# Altium schematic sheet PP_2_0.SchDoc: Плата управления
size 594 x 420 mm; ApprovedBy: Ярмолинская; CheckedBy: Ярмолинская; DrawnBy: Ярмолинский; Organization: Школа №255; DocumentNumber: 53251498.468331.01.04.00 Э3; SheetNumber: 1; SheetTotal: 5; Title1str: электродвигателями; DocumentType: Схема электрическая принципиальная; Format: A2; ImagePath: 53251498.468331.01.02.00
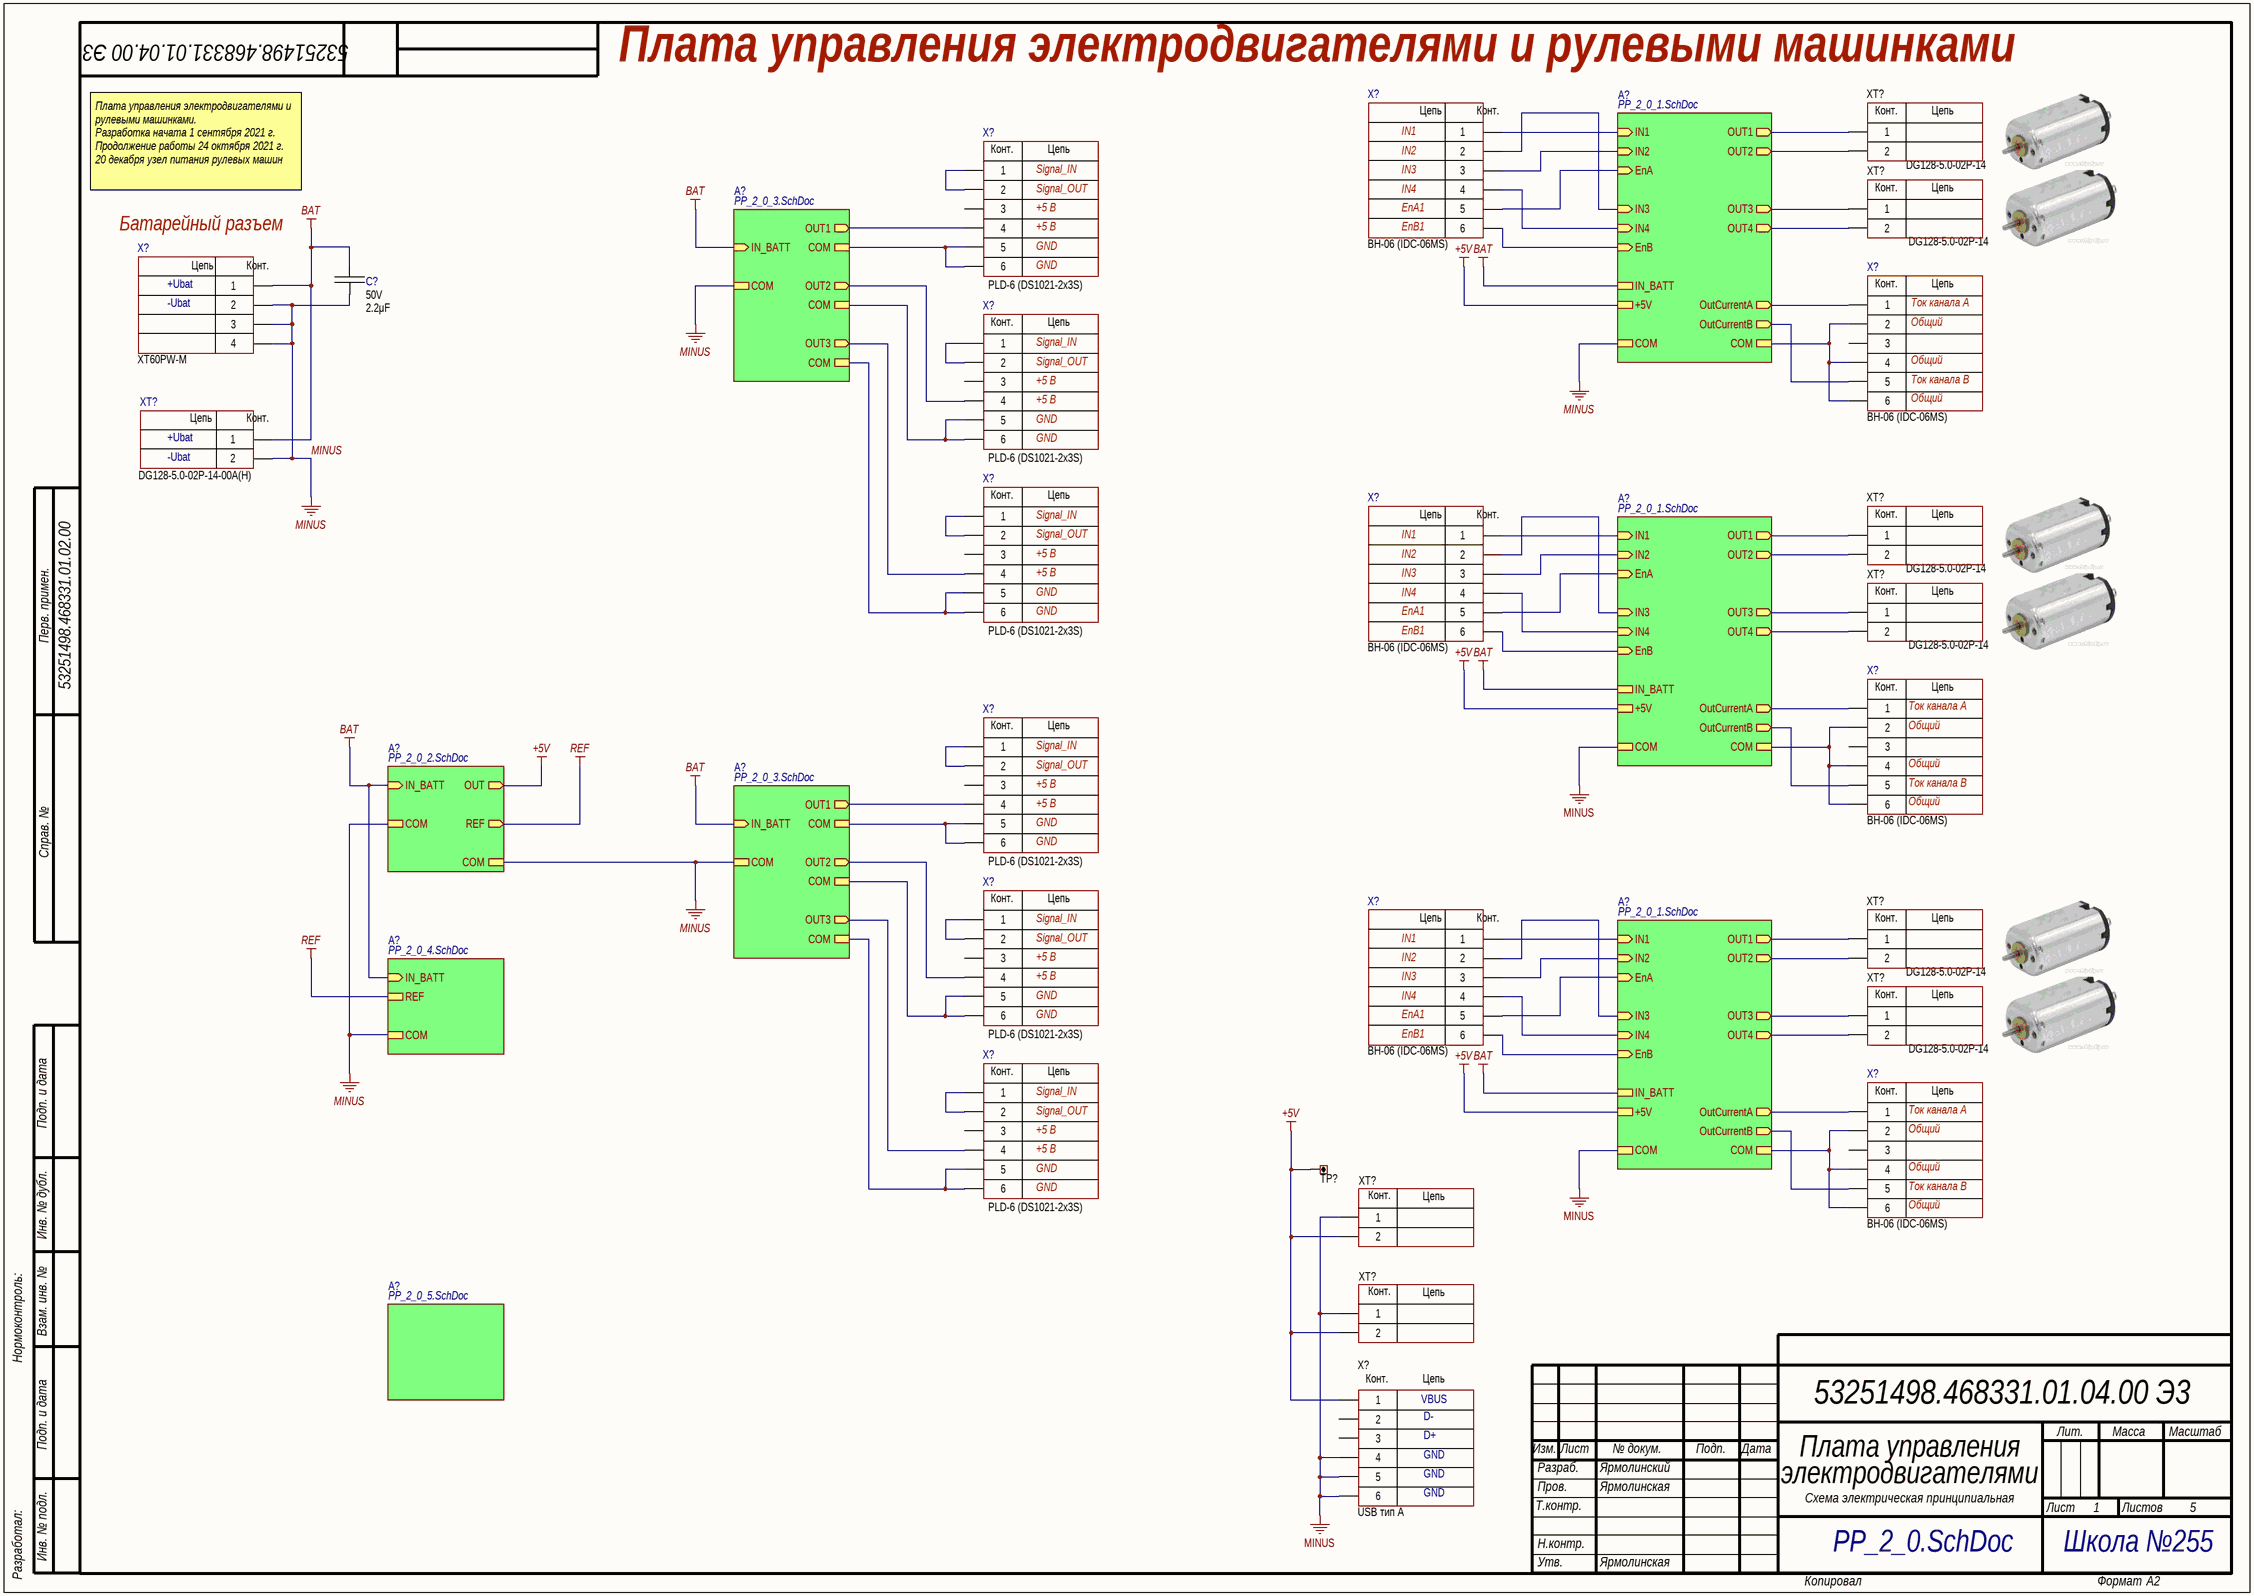
[diagram p0: PP_2_0.SchDoc]

## Parts
(Parts that share a designator on the sheet are numbered #1, #2 ... from top to bottom, then left to right.)
C?  value 2.2μF  Voltage: 50V  [CAP: 1206, Thru-Hole]
TP?  (no value)  [CON: 5000 (Keystone)]
X?#1  CommentText: BH-06 (IDC-06MS)  [CON: IDC-6MS]
X?#2  CommentText: PLD-6 (DS1021-2x3S)  [CON: PLD-6]
X?#3  CommentText: XT60PW-M  [CON: XT60PW-M]
X?#4  CommentText: BH-06 (IDC-06MS)  [CON: IDC-6MS]
X?#5  CommentText: PLD-6 (DS1021-2x3S)  [CON: PLD-6]
X?#6  CommentText: PLD-6 (DS1021-2x3S)  [CON: PLD-6]
X?#7  CommentText: BH-06 (IDC-06MS)  [CON: IDC-6MS]
X?#8  CommentText: BH-06 (IDC-06MS)  [CON: IDC-6MS]
X?#9  CommentText: PLD-6 (DS1021-2x3S)  [CON: PLD-6]
X?#10  CommentText: PLD-6 (DS1021-2x3S)  [CON: PLD-6]
X?#11  CommentText: BH-06 (IDC-06MS)  [CON: IDC-6MS]
X?#12  CommentText: PLD-6 (DS1021-2x3S)  [CON: PLD-6]
X?#13  CommentText: BH-06 (IDC-06MS)  [CON: IDC-6MS]
X?#14  CommentText: USB тип А  [CON: 787761]
XT?#1  CommentText: DG128-5.0-02P-14  [CON: DG128-5.0-02P]
XT?#2  CommentText: DG128-5.0-02P-14  [CON: DG128-5.0-02P]
XT?#3  CommentText: DG128-5.0-02P-14-00A(H)  [CON: DG128-5.0-02P]
XT?#4  CommentText: DG128-5.0-02P-14  [CON: DG128-5.0-02P]
XT?#5  CommentText: DG128-5.0-02P-14  [CON: DG128-5.0-02P]
XT?#6  CommentText: DG128-5.0-02P-14  [CON: DG128-5.0-02P]
XT?#7  CommentText: DG128-5.0-02P-14  [CON: DG128-5.0-02P]
XT?#8  (no value)  [CON: DG128-5.0-02P]
XT?#9  (no value)  [CON: DG128-5.0-02P]

## Sub-sheets
A? = PP_2_0_1.SchDoc: OutCurrentB (out), IN3 (in), IN4 (in), EnB (in), OUT3 (out), OUT2 (out), OUT1 (out), OUT4 (out), IN2 (in), IN1 (in), EnA (in), OutCurrentA (out), IN_BATT, +5V, COM, COM
A? = PP_2_0_2.SchDoc: REF (out), COM, IN_BATT (in), COM, OUT (out)
A? = PP_2_0_3.SchDoc: OUT2 (out), IN_BATT (in), OUT3 (out), COM, OUT1 (out), COM, COM, COM
A? = PP_2_0_4.SchDoc: IN_BATT (in), COM, REF
A? = PP_2_0_3.SchDoc: OUT2 (out), IN_BATT (in), OUT3 (out), COM, OUT1 (out), COM, COM, COM
A? = PP_2_0_1.SchDoc: OutCurrentB (out), IN3 (in), IN4 (in), EnB (in), OUT3 (out), OUT2 (out), OUT1 (out), OUT4 (out), IN2 (in), IN1 (in), EnA (in), OutCurrentA (out), IN_BATT, +5V, COM, COM
A? = PP_2_0_1.SchDoc: OutCurrentB (out), IN3 (in), IN4 (in), EnB (in), OUT3 (out), OUT2 (out), OUT1 (out), OUT4 (out), IN2 (in), IN1 (in), EnA (in), OutCurrentA (out), IN_BATT, +5V, COM, COM
A? = PP_2_0_5.SchDoc: no entries

## Nets
+5V: TP?.1 X?#14.1 XT?#8.2 XT?#9.2 ; sheet A?/+5V, sheet A?/OUT, sheet A?/+5V, sheet A?/+5V
BAT: C?.2 X?#3.1 XT?#3.1 ; sheet A?/IN_BATT, sheet A?/IN_BATT, sheet A?/IN_BATT, sheet A?/IN_BATT, sheet A?/IN_BATT, sheet A?/IN_BATT, sheet A?/IN_BATT
MINUS: C?.1 X?#3.2 X?#3.3 X?#3.4 X?#14.4 X?#14.5 X?#14.6 XT?#3.2 XT?#8.1 XT?#9.1 ; sheet A?/COM, sheet A?/COM, sheet A?/COM, sheet A?/COM, sheet A?/COM, sheet A?/COM, sheet A?/COM, sheet A?/COM
REF: sheet A?/REF, sheet A?/REF
NetX?#1_1: X?#1.1 ; sheet A?/IN1
NetX?#1_2: X?#1.2 ; sheet A?/IN3
NetX?#1_3: X?#1.3 ; sheet A?/IN2
NetX?#1_4: X?#1.4 ; sheet A?/IN4
NetX?#1_5: X?#1.5 ; sheet A?/EnA
NetX?#1_6: X?#1.6 ; sheet A?/EnB
NetX?#2_1: X?#2.1 X?#2.2
NetX?#2_4: X?#2.4 ; sheet A?/OUT1
NetX?#2_5: X?#2.5 X?#2.6 ; sheet A?/COM
NetX?#4_1: X?#4.1 ; sheet A?/OutCurrentA
NetX?#4_2: X?#4.2 X?#4.4 X?#4.6 ; sheet A?/COM
NetX?#4_5: X?#4.5 ; sheet A?/OutCurrentB
NetX?#5_1: X?#5.1 X?#5.2
NetX?#5_4: X?#5.4 ; sheet A?/OUT2
NetX?#5_5: X?#5.5 X?#5.6 ; sheet A?/COM
NetX?#6_1: X?#6.1 X?#6.2
NetX?#6_4: X?#6.4 ; sheet A?/OUT3
NetX?#6_5: X?#6.5 X?#6.6 ; sheet A?/COM
NetX?#7_1: X?#7.1 ; sheet A?/IN1
NetX?#7_2: X?#7.2 ; sheet A?/IN3
NetX?#7_3: X?#7.3 ; sheet A?/IN2
NetX?#7_4: X?#7.4 ; sheet A?/IN4
NetX?#7_5: X?#7.5 ; sheet A?/EnA
NetX?#7_6: X?#7.6 ; sheet A?/EnB
NetX?#8_1: X?#8.1 ; sheet A?/OutCurrentA
NetX?#8_2: X?#8.2 X?#8.4 X?#8.6 ; sheet A?/COM
NetX?#8_5: X?#8.5 ; sheet A?/OutCurrentB
NetX?#9_1: X?#9.1 X?#9.2
NetX?#9_4: X?#9.4 ; sheet A?/OUT1
NetX?#9_5: X?#9.5 X?#9.6 ; sheet A?/COM
NetX?#10_1: X?#10.1 X?#10.2
NetX?#10_4: X?#10.4 ; sheet A?/OUT2
NetX?#10_5: X?#10.5 X?#10.6 ; sheet A?/COM
NetX?#11_1: X?#11.1 ; sheet A?/IN1
NetX?#11_2: X?#11.2 ; sheet A?/IN3
NetX?#11_3: X?#11.3 ; sheet A?/IN2
NetX?#11_4: X?#11.4 ; sheet A?/IN4
NetX?#11_5: X?#11.5 ; sheet A?/EnA
NetX?#11_6: X?#11.6 ; sheet A?/EnB
NetX?#12_1: X?#12.1 X?#12.2
NetX?#12_4: X?#12.4 ; sheet A?/OUT3
NetX?#12_5: X?#12.5 X?#12.6 ; sheet A?/COM
NetX?#13_1: X?#13.1 ; sheet A?/OutCurrentA
NetX?#13_2: X?#13.2 X?#13.4 X?#13.6 ; sheet A?/COM
NetX?#13_5: X?#13.5 ; sheet A?/OutCurrentB
NetXT?#1_1: XT?#1.1 ; sheet A?/OUT1
NetXT?#1_2: XT?#1.2 ; sheet A?/OUT2
NetXT?#2_1: XT?#2.1 ; sheet A?/OUT3
NetXT?#2_2: XT?#2.2 ; sheet A?/OUT4
NetXT?#4_1: XT?#4.1 ; sheet A?/OUT1
NetXT?#4_2: XT?#4.2 ; sheet A?/OUT2
NetXT?#5_1: XT?#5.1 ; sheet A?/OUT3
NetXT?#5_2: XT?#5.2 ; sheet A?/OUT4
NetXT?#6_1: XT?#6.1 ; sheet A?/OUT1
NetXT?#6_2: XT?#6.2 ; sheet A?/OUT2
NetXT?#7_1: XT?#7.1 ; sheet A?/OUT3
NetXT?#7_2: XT?#7.2 ; sheet A?/OUT4

Not connected (* = marked no-connect by the designer): X?#2 3; X?#4 3; X?#5 3; X?#6 3; X?#8 3; X?#9 3; X?#10 3; X?#12 3; X?#13 3; X?#14 2 3

## Notes on the sheet
- Плата управления электродвигателями и рулевыми машинками
- IN1
- IN2
- Плата управления электродвигателями и рулевыми машинками.
  Разработка начата 1 сентября 2021 г.
  Продолжение работы 24 октября 2021 г.
  20 декабря узел питания рулевых машин
- Signal_IN
- Signal_OUT
- +5 В
- EnA1
- IN3
- IN4
- Батарейный разъем
- GND
- EnB1
- +Ubat
- -Ubat
- Ток канала A
- Общий
- Ток канала B
- Перв. примен.
- Справ. №
- Подп. и дата
- Инв. № дубл.
- Нормоконтроль:
- Взам. инв. №
- Изм.
- Лист
- № докум.
- Подп.
- Дата
- Лит.
- Масса
- Масштаб
- Т.контр.
- Пров.
- Разраб.
- Листов
- Разработал:
- Инв. № подл.
- Н.контр.
- Утв.
- Копировал
- Формат
- (in symbol Connector_IDC_6pin) Цепь; Конт.
- (in symbol Connector_terminal_2pin) Конт.; Цепь
- (in symbol Connector_terminal_2pin DG128-5.0-02P) Цепь; Конт.
- (in symbol Connector_USB_4+2pin) Конт.; Цепь; VBUS; D-; D+; GND
- (in symbol Connector_XT60PW-M) Цепь; Конт.

## Library data of the parts
C? = Ceramic_1210: К10-17Б имп. 2.2мкФ Y5V, +/-20%,1206; Manufacturer: Murata; PartNumber: CERCAP2.2/50V1206MY5V; ValueManufacturerPartNumber: Ceramic capacitor, 2.2μF, X7R, ±20%, 50V, 1210, -55...+125°C; TypeCapacitor: Ceramic capacitor; Tolerance: ±20%; TypeDielectric: X7R; Nom_Nom: 224600416; Package: 1210; HelpURL: https://www.digikey.com/product-detail/en/yageo/CC1210KKX7R9BB104/311-4522-1-ND/8025611; Temperature: -55...+125°C
TP? = Connector_Test_Point: Manufacturer: Keystone; ValueManufacturerPartNumber: Test point, Keystone, 5001; PartNumber: 5001; TypeConnector: Test point; HelpURL: https://www.digikey.com/product-detail/en/keystone-electronics/5001/36-5001-ND/255327
X?#1 X?#4 X?#7 X?#8 X?#11 X?#13 = Connector_IDC_6pin: IDC, 6pin; Manufacturer: Connfly; ValueManufacturerPartNumber: IDC connector, 6pin, 2.54mm, 300VAC, 1A; PartNumber: DS1013-06SSiB1-B-0; TypeConnector: IDC connector; VoltageMax: 300VAC; Pitch: 2.54mm; CurrentMax: 1A; HelpURL: https://www.chipdip.ru/product/idc-06ms-bh-06; Multichannel: 6pin
X?#2 X?#5 X?#6 X?#9 X?#10 X?#12 = Connector_IDC_6pin: PLD-6 (DS1021-2x3S), Вилка штыревая 2.54мм 2x3 прямая тип1; Manufacturer: KLS; ValueManufacturerPartNumber: PLD connector, 6pin, 2.54mm, 300VAC, 1A; PartNumber: DS1021-2*3SF11-B; TypeConnector: PLD connector; VoltageMax: 300VAC; Pitch: 2.54mm; CurrentMax: 1A; Multichannel: 6pin; HelpURL: https://www.chipdip.ru/product/pld-6
X?#3 = Connector_XT60PW-M: Battery power; Manufacturer: AMASS; ValueManufacturerPartNumber: Battery power connector, 4pin, 5mm, 300VAC, 10A; TypeConnector: Battery power connector; VoltageMax: 300VAC; Pitch: 5mm; CurrentMax: 10A; Multichannel: 4pin; HelpURL: https://www.chipdip.ru/product0/8007758661; PartNumber: XT60PW-M
X?#14 = Connector_USB_4+2pin: USB разъем тип А; Manufacturer: TEConnectivity; PartNumber: USBA-1J; TypeConnector: USB type A connector; Multichannel: 4pin; HelpURL: https://www.chipdip.ru/product/292303-1-te; ValueManufacturerPartNumber: =TypeConnector+', '+Multichannel+', '+Pitch+', '+VoltageMax+', '+CurrentMax
XT?#1 XT?#2 XT?#4-XT?#7 = Connector_terminal_2pin DG128-5.0-02P: DG128-5.0-02P-14, Клеммник 2-контактный, 5мм, прямой; Manufacturer: Degson; ValueManufacturerPartNumber: Terminal connector, 2pin, 5mm, 300VAC, 10A; PartNumber: DG128-5.0-02P-14-00A(H); TypeConnector: Terminal connector; VoltageMax: 300VAC; Pitch: 5mm; CurrentMax: 10A; Multichannel: 2pin; HelpURL: https://www.chipdip.ru/product/dg128-5.0-02p-14
XT?#3 = Connector_terminal_2pin DG128-5.0-02P: DG128-5.0-02P-14, Клеммник 2-контактный, 5мм, прямой; Manufacturer: Degson; ValueManufacturerPartNumber: Terminal connector, 2pin, 5mm, 300VAC, 10A; TypeConnector: Terminal connector; VoltageMax: 300VAC; Pitch: 5mm; CurrentMax: 10A; Multichannel: 2pin; HelpURL: https://www.chipdip.ru/product/dg128-5.0-02p-14; PartNumber: DG128-5.0-02P-14-00A(H)
XT?#8 XT?#9 = Connector_terminal_2pin: Клеммник 2 клеммы; Manufacturer: Degson; ValueManufacturerPartNumber: Terminal connector, 4pin, 5mm, 300VAC, 10A; PartNumber: DG126-5.0-04P-14; TypeConnector: Terminal connector; VoltageMax: 300VAC; Pitch: 5mm; CurrentMax: 10A; Multichannel: 4pin; CommentText: "Разъем"; HelpURL: https://www.chipdip.ru/product/dg350-3.5-03p-12